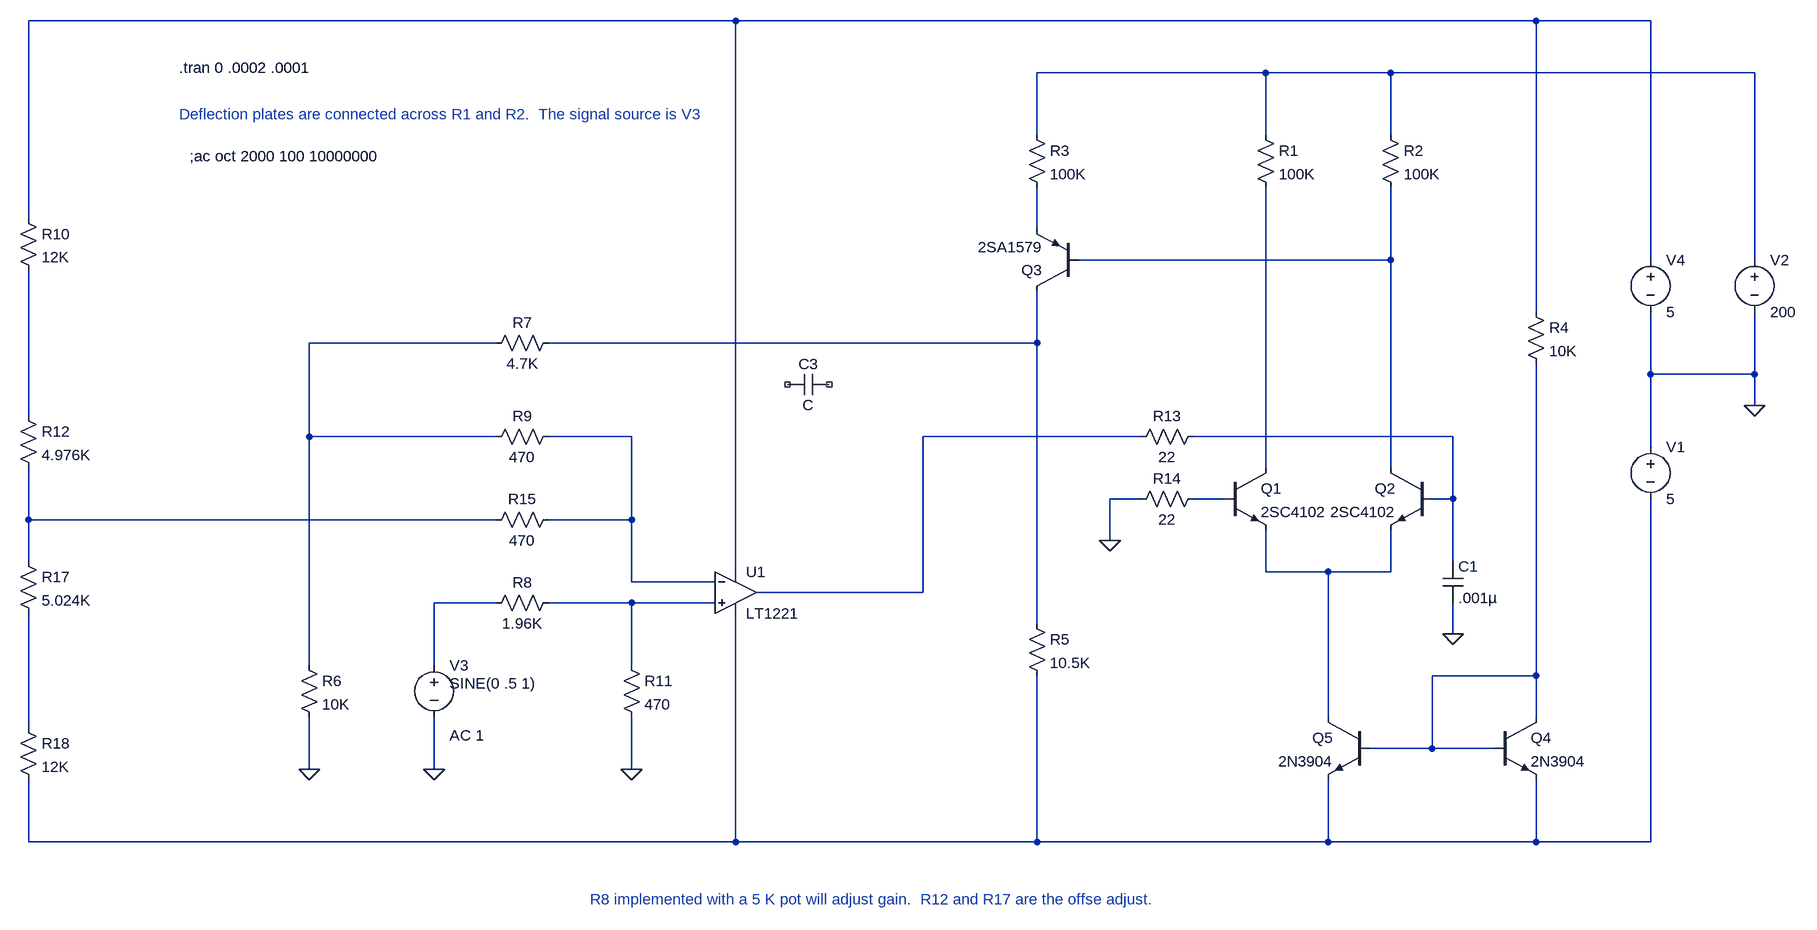
[diagram p0: schematic inspired dif amp.asc]
inspired dif amp.asc, the LTspice schematic file:
Version 4
SHEET 1 2464 904
WIRE 160 -464 -928 -464
WIRE 1392 -464 160 -464
WIRE 1568 -464 1392 -464
WIRE 976 -384 624 -384
WIRE 1168 -384 976 -384
WIRE 1728 -384 1168 -384
WIRE 624 -288 624 -384
WIRE 976 -288 976 -384
WIRE 1168 -288 1168 -384
WIRE -928 -160 -928 -464
WIRE 624 -144 624 -208
WIRE 1168 -96 1168 -208
WIRE 1168 -96 688 -96
WIRE 1568 -96 1568 -464
WIRE 1728 -96 1728 -384
WIRE 1392 -16 1392 -464
WIRE -208 32 -496 32
WIRE 624 32 624 -48
WIRE 624 32 -128 32
WIRE 1568 80 1568 -16
WIRE 1728 80 1728 -16
WIRE 1728 80 1568 80
WIRE 1728 128 1728 80
WIRE -928 144 -928 -80
WIRE -496 176 -496 32
WIRE -208 176 -496 176
WIRE 0 176 -128 176
WIRE 784 176 448 176
WIRE 1264 176 864 176
WIRE 1568 192 1568 80
WIRE 976 224 976 -208
WIRE 1168 224 1168 -96
WIRE 784 272 736 272
WIRE 912 272 864 272
WIRE 1264 272 1264 176
WIRE 1264 272 1232 272
WIRE -928 304 -928 224
WIRE -208 304 -928 304
WIRE 0 304 0 176
WIRE 0 304 -128 304
WIRE 736 336 736 272
WIRE -928 368 -928 304
WIRE 1264 368 1264 272
WIRE 160 384 160 -464
WIRE 976 384 976 320
WIRE 1072 384 976 384
WIRE 1168 384 1168 320
WIRE 1168 384 1072 384
WIRE 0 400 0 304
WIRE 128 400 0 400
WIRE 448 416 448 176
WIRE 448 416 192 416
WIRE -208 432 -304 432
WIRE 0 432 -128 432
WIRE 128 432 0 432
WIRE 624 464 624 32
WIRE 1264 480 1264 432
WIRE -496 528 -496 176
WIRE -304 528 -304 432
WIRE 0 528 0 432
WIRE 1392 544 1392 64
WIRE 1392 544 1232 544
WIRE 1072 608 1072 384
WIRE 1392 608 1392 544
WIRE -928 624 -928 448
WIRE 1232 656 1232 544
WIRE 1232 656 1136 656
WIRE 1328 656 1232 656
WIRE -496 688 -496 608
WIRE -304 688 -304 608
WIRE 0 688 0 608
WIRE -928 800 -928 704
WIRE 160 800 160 448
WIRE 160 800 -928 800
WIRE 624 800 624 544
WIRE 624 800 160 800
WIRE 1072 800 1072 704
WIRE 1072 800 624 800
WIRE 1392 800 1392 704
WIRE 1392 800 1072 800
WIRE 1568 800 1568 272
WIRE 1568 800 1392 800
FLAG 1728 128 0
FLAG -304 688 0
FLAG -496 688 0
FLAG 0 688 0
FLAG 736 336 0
FLAG 1264 480 0
SYMBOL npn 912 224 R0
SYMATTR InstName Q1
SYMATTR Value 2SC4102
SYMBOL npn 1232 224 M0
SYMATTR InstName Q2
SYMATTR Value 2SC4102
SYMBOL res 960 -304 R0
SYMATTR InstName R1
SYMATTR Value 100K
SYMBOL res 1152 -304 R0
SYMATTR InstName R2
SYMATTR Value 100K
SYMBOL pnp 688 -48 R180
SYMATTR InstName Q3
SYMATTR Value 2SA1579
SYMBOL res 608 -304 R0
SYMATTR InstName R3
SYMATTR Value 100K
SYMBOL res 1376 -32 R0
SYMATTR InstName R4
SYMATTR Value 10K
SYMBOL voltage 1568 176 R0
WINDOW 123 0 0 Left 2
WINDOW 39 0 0 Left 2
SYMATTR InstName V1
SYMATTR Value 5
SYMBOL res 608 448 R0
SYMATTR InstName R5
SYMATTR Value 10.5K
SYMBOL voltage 1728 -112 R0
WINDOW 123 0 0 Left 2
WINDOW 39 0 0 Left 2
SYMATTR InstName V2
SYMATTR Value 200
SYMBOL voltage -304 512 R0
WINDOW 123 24 124 Left 2
WINDOW 39 0 0 Left 2
WINDOW 3 24 44 Left 2
SYMATTR Value2 AC 1
SYMATTR Value SINE(0 .5 1)
SYMATTR InstName V3
SYMBOL voltage 1568 -112 R0
WINDOW 123 0 0 Left 2
WINDOW 39 0 0 Left 2
SYMATTR InstName V4
SYMATTR Value 5
SYMBOL npn 1328 608 R0
SYMATTR InstName Q4
SYMATTR Value 2N3904
SYMBOL npn 1136 608 M0
SYMATTR InstName Q5
SYMATTR Value 2N3904
SYMBOL res -512 512 R0
SYMATTR InstName R6
SYMATTR Value 10K
SYMBOL res -112 16 R90
WINDOW 0 0 56 VBottom 2
WINDOW 3 32 56 VTop 2
SYMATTR InstName R7
SYMATTR Value 4.7K
SYMBOL res -16 512 R0
SYMATTR InstName R11
SYMATTR Value 470
SYMBOL Opamps\\LT1221 160 352 R0
SYMATTR InstName U1
SYMBOL res 880 160 R90
WINDOW 0 0 56 VBottom 2
WINDOW 3 32 56 VTop 2
SYMATTR InstName R13
SYMATTR Value 22
SYMATTR SpiceLine tol=1 pwr=0.1
SYMBOL res 880 256 R90
WINDOW 0 0 56 VBottom 2
WINDOW 3 32 56 VTop 2
SYMATTR InstName R14
SYMATTR Value 22
SYMATTR SpiceLine tol=1 pwr=0.1
SYMBOL res -112 288 R90
WINDOW 0 0 56 VBottom 2
WINDOW 3 32 56 VTop 2
SYMATTR InstName R15
SYMATTR Value 470
SYMBOL res -112 416 R90
WINDOW 0 0 56 VBottom 2
WINDOW 3 32 56 VTop 2
SYMATTR InstName R8
SYMATTR Value 1.96K
SYMATTR SpiceLine tol=1 pwr=0.1
SYMBOL res -112 160 R90
WINDOW 0 0 56 VBottom 2
WINDOW 3 32 56 VTop 2
SYMATTR InstName R9
SYMATTR Value 470
SYMBOL res -944 -176 R0
SYMATTR InstName R10
SYMATTR Value 12K
SYMBOL res -944 128 R0
SYMATTR InstName R12
SYMATTR Value 4.976K
SYMBOL res -944 352 R0
SYMATTR InstName R17
SYMATTR Value 5.024K
SYMBOL res -944 608 R0
SYMATTR InstName R18
SYMATTR Value 12K
SYMBOL cap 1248 368 R0
SYMATTR InstName C1
SYMATTR Value .001µ
SYMBOL cap 304 80 R90
WINDOW 0 0 32 VBottom 2
WINDOW 3 32 32 VTop 2
SYMATTR InstName C3
TEXT -64 888 Left 2 ;R8 implemented with a 5 K pot will adjust gain.  R12 and R17 are the offse adjust.
TEXT -696 -320 Left 2 ;Deflection plates are connected across R1 and R2.  The signal source is V3
TEXT -696 -392 Left 2 !.tran 0 .0002 .0001
TEXT -680 -256 Left 2 !;ac oct 2000 100 10000000

The netlist it stands for:
* inspired dif amp.asc
Q1 N011 N012 N014 0 2SC4102
Q2 N004 N010 N014 0 2SC4102
R1 N002 N011 100K
R2 N002 N004 100K
Q3 N006 N004 N003 0 2SA1579
R3 N002 N003 100K
R4 N001 N017 10K
V1 0 N019 5
R5 N006 N019 10.5K
V2 N002 0 200
V3 N015 0 SINE(0 .5 1) AC 1
V4 N001 0 5
Q4 N017 N017 N019 0 2N3904
Q5 N014 N017 N019 0 2N3904
R6 N005 0 10K
R7 N006 N005 4.7K
R11 N016 0 470
XU1 N016 N008 N001 N019 N009 LT1221  ; pins In+ In- V+ V- OUT
R13 N010 N009 22 tol=1 pwr=0.1
R14 N012 0 22 tol=1 pwr=0.1
R15 N008 N013 470
R8 N016 N015 1.96K tol=1 pwr=0.1
R9 N008 N005 470
R10 N001 N007 12K
R12 N007 N013 4.976K
R17 N013 N018 5.024K
R18 N018 N019 12K
C1 N010 0 .001µ
C3 NC_01 NC_02 C
.model NPN NPN
.model PNP PNP
.lib standard.bjt
* R8 implemented with a 5 K pot will adjust gain.  R12 and R17 are the offse adjust.
* Deflection plates are connected across R1 and R2.  The signal source is V3
.tran 0 .0002 .0001
;ac oct 2000 100 10000000
.backanno
.end